# EAGLE design feedline (EAGLE 9.5.0)
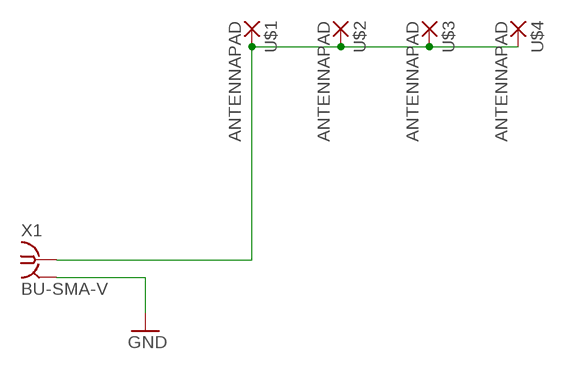
[diagram p0: schematic, sheet 1]

## Parts
U$1  ANTENNAPAD  [CMMOUNTPAD]
U$2  ANTENNAPAD  [CMMOUNTPAD]
U$3  ANTENNAPAD  [CMMOUNTPAD]
U$4  ANTENNAPAD  [CMMOUNTPAD]
X1  BU-SMA-V  [BU-SMA-V]

## Nets
FEED: U$1.P$1(P) U$2.P$1(P) U$3.P$1(P) U$4.P$1(P) X1.1
GND: X1.2 X1.3 X1.4 X1.5

## Library data of the parts
U$1-U$4 = AntennaPad:ANTENNAPAD
X1 = con-coax:BU-SMA-V: FEMALE SMA CONNECTOR Radiall distributor RS 112-3794; OC_FARNELL: unknown; OC_NEWARK: unknown

## Board
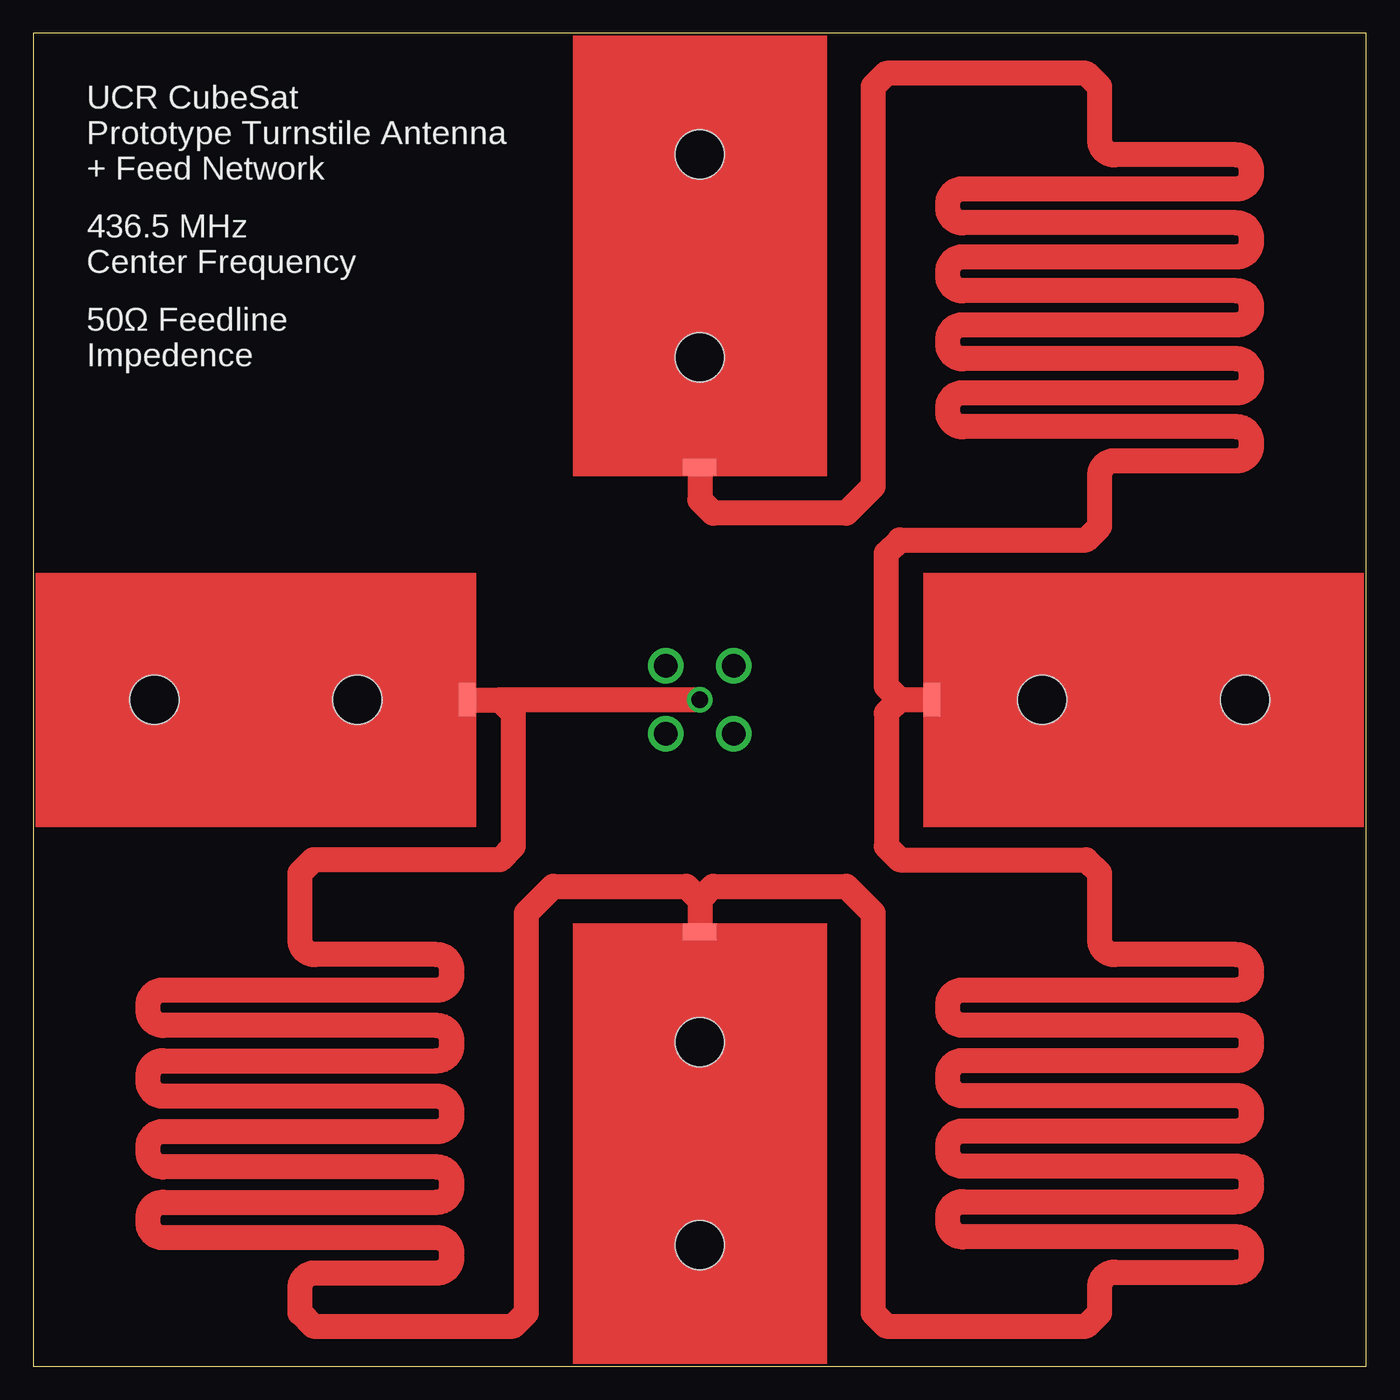
[diagram p1: board, top side]
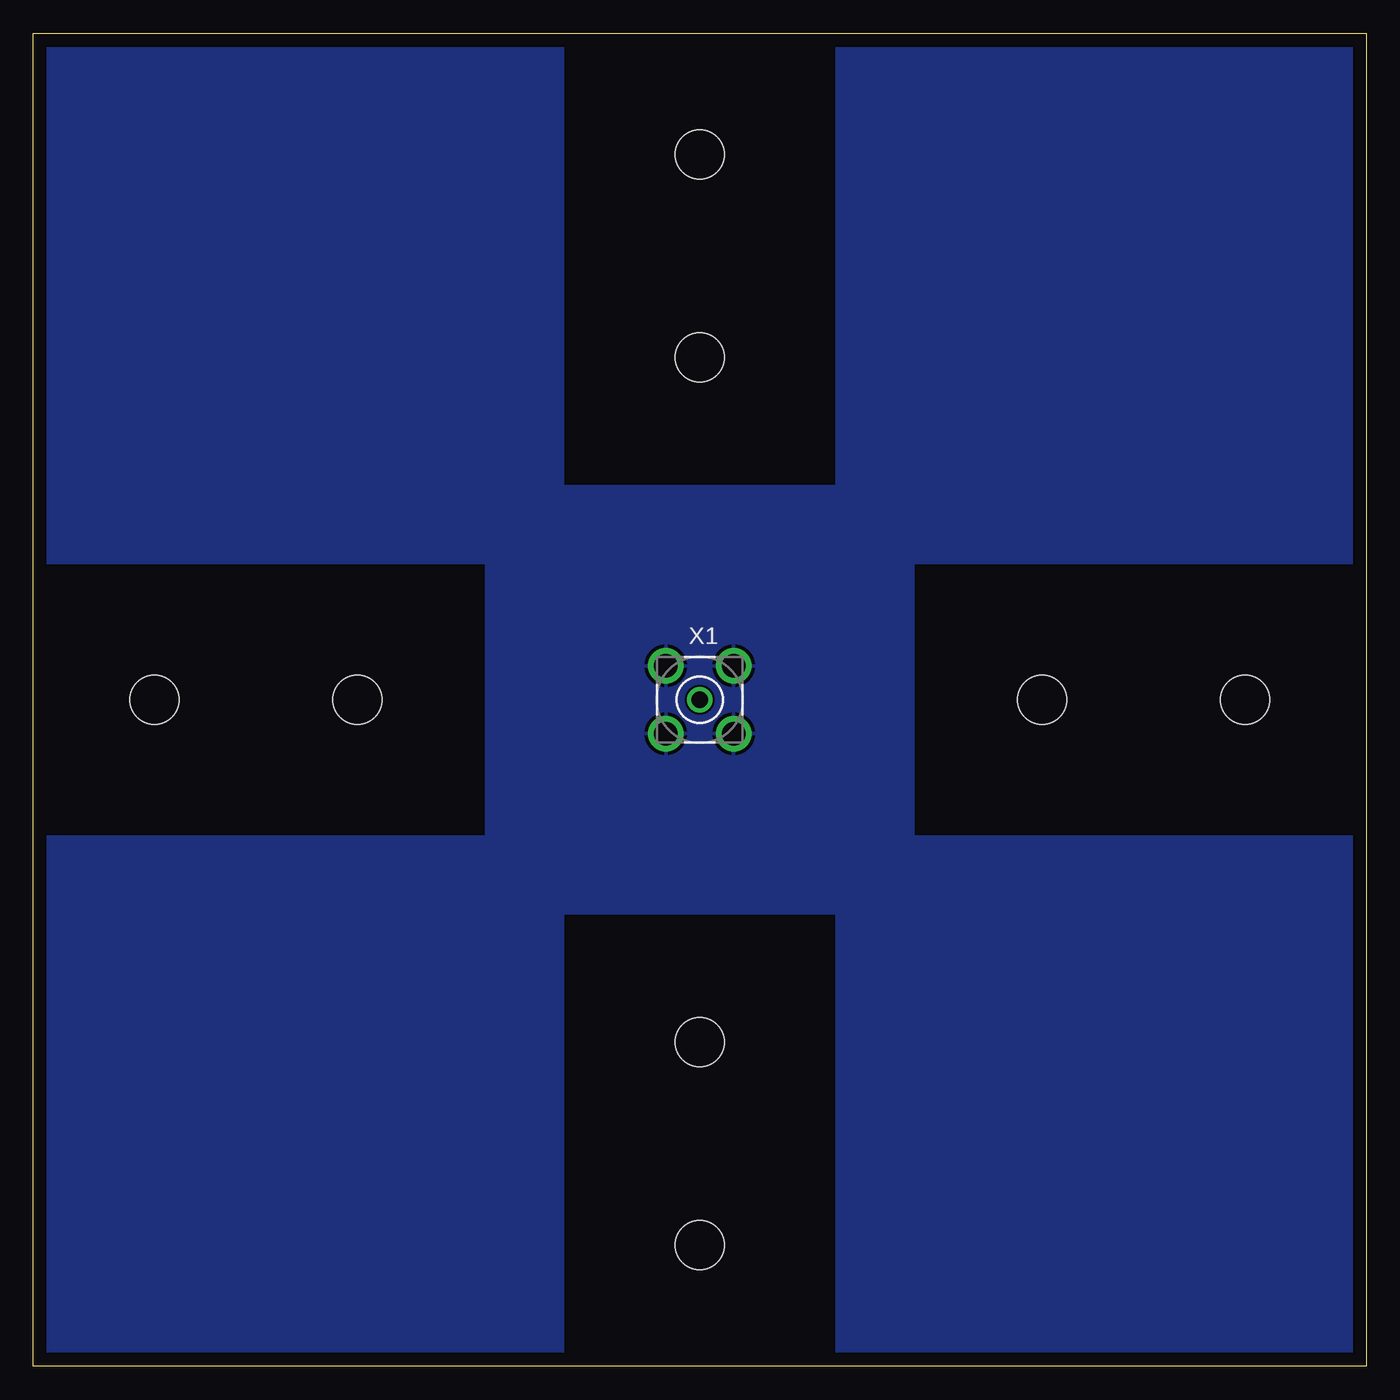
[diagram p2: board, bottom side, seen from below]

Size 100 x 100 mm. Coordinates in mm from the lower left corner, seen from the top.
Outline: 0,0 100,0 100,100 0,100 0,0
Copper layers (1*16): Top 0.035mm / dielectric 1.5mm / Bottom 0.035mm
Design rules "default": minimum track width 6mil, minimum drill 0.35mm, track to track 6mil, track to pad 6mil, pad to pad 6mil, via to via 6mil, smd to smd 6mil, copper to edge 40mil, drill to drill 6mil, minimum pad ring 10mil, minimum via ring 8mil, stop-mask expansion 4mil, vias tented up to drill 0mil, thermal gap 10mil

### Footprints (pad centres in the part's own frame; a part is rotated, then mirrored left to right if it is on the bottom)
CMMOUNTPAD = smd 1.27 x 2.54: P$1 15.875,0 | hole 3.708: -7.62,0; 7.62,0; -7.62,0; -7.62,0; 7.62,0
BU-SMA-V = drill 1.27: 1 0,0 | drill 1.778: 2 -2.55,2.55; 3 2.55,2.55; 4 2.55,-2.55; 5 -2.55,-2.55

### Placement (x,y rotation side)
U$1  16.7,50 0 top
U$2  50,16.7 90 top
U$3  83.3,50 180 top
U$4  50,83.3 270 top
X1  50,50 0 bottom

### Tracks (layer width: path | path; a pad name or v marks a point on that pad's centre or on a via)
FEED
  Top 1.867: U$1.P$1 35,50 | U$4.P$1 50,65 51,64 61,64 63,66 63,96 64,97 79,97 80,96 80,92 arc90 81.12,90.88 90.27,90.88 arc-90 91.4,89.75 91.4,89.45 arc-90 90.27,88.33 69.73,88.33 arc90 68.6,87.2 68.6,86.9 arc90 69.73,85.78 90.27,85.78 arc-90 91.4,84.65 91.4,84.35 arc-90 90.27,83.23 69.73,83.23 arc90 68.6,82.1 68.6,81.8 arc90 69.73,80.68 90.27,80.68 arc-90 91.4,79.56 91.4,79.25 arc-90 90.27,78.13 69.73,78.13 arc90 68.6,77.01 68.6,76.7 arc90 69.73,75.58 90.27,75.58 arc-90 91.4,74.46 91.4,74.16 arc-90 90.27,73.03 69.73,73.03 arc90 68.6,71.91 68.6,71.61 arc90 69.73,70.48 90.27,70.48 arc-90 91.4,69.36 91.4,69.06 arc-90 90.27,67.93 81.12,67.93 arc90 80,66.81 80,63 79,62 65,62 64,61 64,51 65,50 | 50,35 U$2.P$1 | U$3.P$1 65,50 | 35,50 36,49 36,39 35,38 21,38 20,37 20,32 arc90 21.12,30.88 30.27,30.88 arc-90 31.39,29.75 31.39,29.35 arc-90 30.27,28.22 9.73,28.22 arc90 8.6,27.1 8.6,26.69 arc90 9.73,25.57 30.27,25.57 arc-90 31.39,24.44 31.39,24.04 arc-90 30.27,22.91 9.73,22.91 arc90 8.6,21.79 8.6,21.38 arc90 9.73,20.26 30.27,20.26 arc-90 31.39,19.14 31.39,18.73 arc-90 30.27,17.61 9.73,17.61 arc90 8.6,16.48 8.6,16.08 arc90 9.73,14.95 30.27,14.95 arc-90 31.39,13.83 31.39,13.42 arc-90 30.27,12.3 9.73,12.3 arc90 8.6,11.17 8.6,10.77 arc90 9.73,9.64 30.27,9.64 arc-90 31.39,8.52 31.39,8.11 arc-90 30.27,6.99 21.12,6.99 arc90 20,5.87 20,4 21,3 36,3 37,4 37,34 39,36 49,36 50,35 | 50,35 51,36 61,36 63,34 63,4 64,3 79,3 80,4 80,5.93 arc-90 81.12,7.06 90.27,7.06 arc90 91.4,8.18 91.4,8.58 arc90 90.27,9.7 69.73,9.7 arc-90 68.61,10.83 68.61,11.23 arc-90 69.73,12.35 90.27,12.35 arc90 91.4,13.47 91.4,13.87 arc90 90.27,15 69.73,15 arc-90 68.61,16.12 68.61,16.52 arc-90 69.73,17.64 90.27,17.64 arc90 91.4,18.77 91.4,19.16 arc90 90.27,20.29 69.73,20.29 arc-90 68.61,21.41 68.61,21.81 arc-90 69.73,22.94 90.27,22.94 arc90 91.4,24.06 91.4,24.46 arc90 90.27,25.58 69.73,25.58 arc-90 68.61,26.71 68.61,27.11 arc-90 69.73,28.23 90.27,28.23 arc90 91.4,29.35 91.4,29.75 arc90 90.27,30.88 81.12,30.88 arc-90 80,32 80,37 79,38 65,38 64,39 64,49 65,50
  Top 1.867: X1.1 35,50
GND
  pour Bottom: 0,100 100,100 100,0 0,0

### Text on the board
tPlace: UCR CubeSat / Prototype Turnstile Antenna / + Feed Network | 436.5 MHz / Center Frequency | 50Ω Feedline / Impedence